# Altium schematic sheet Attachments.SchDoc
size A
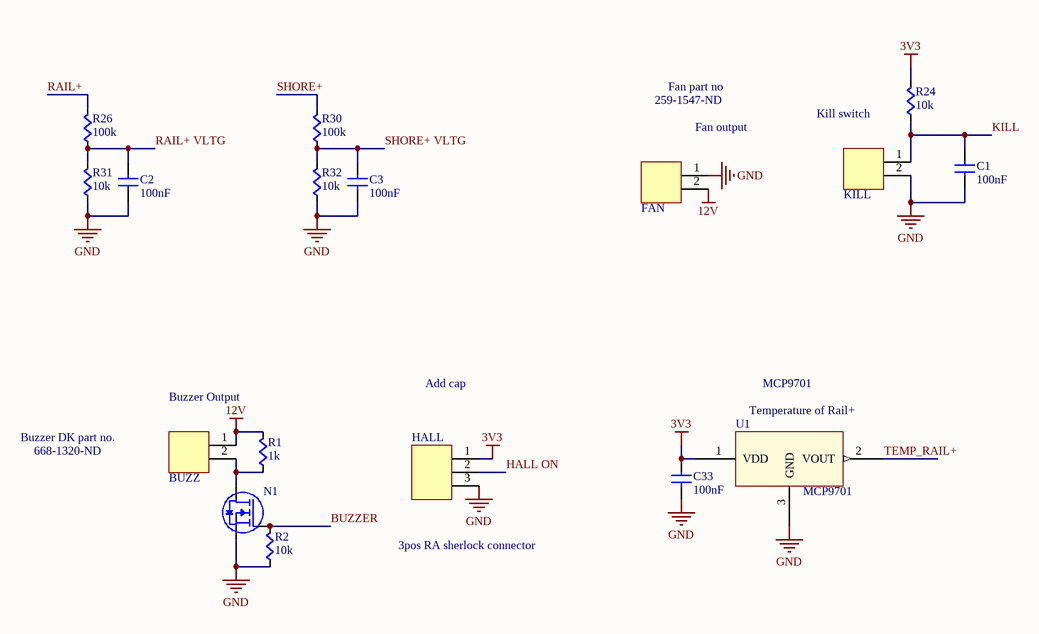
[diagram p0: Attachments.SchDoc]

## Parts
BUZZ  2-pin Horz Sherlock  [MOLEX-HDR-1X2-SHERLOCK-HORZ]  (value not drawn)
C1  value 100nF  [CAPC0603]  (hidden comment: Cap)
C2  value 100nF  [CAPC0603]  (hidden comment: Cap)
C3  value 100nF  [CAPC0603]  (hidden comment: Cap)
C33  value 100nF  [CAPC0603]  (hidden comment: Cap)
FAN  2-pin Horz Sherlock  [MOLEX-HDR-1X2-SHERLOCK-HORZ]  (value not drawn)
HALL  3pos RA sherlock connector  [MOLEX-HDR-1X3-SHERLOCK-RA]
KILL  2-pin Horz Sherlock  [MOLEX-HDR-1X2-SHERLOCK-HORZ]  (value not drawn)
N1  NMOSFET  [2N7002P,215]  (value not drawn)
R1  value 1k  [RES0603]  (hidden comment: Res)
R2  value 10k  [RES0603]  (hidden comment: Res)
R24  value 10k  [RES0603]  (hidden comment: Res)
R26  value 100k  [RES0603]  (hidden comment: Res)
R30  value 100k  [RES0603]  (hidden comment: Res)
R31  value 10k  [RES0603]  (hidden comment: Res)
R32  value 10k  [RES0603]  (hidden comment: Res)
U1  MCP9701  [MCP970X-E/TT]

## Nets
3V3: C33.2(B) HALL.1 R24.1(A) U1.1(VDD)
12V: BUZZ.1 FAN.2 R1.1(A)
GND: C1.2(B) C2.2(B) C3.2(B) C33.1(A) FAN.1 HALL.3 KILL.2 N1.2(S) R2.2(B) R31.2(B) R32.2(B) U1.3(GND)
BUZZER: N1.1(G) R2.1(A)
HALL ON: HALL.2
KILL: C1.1(A) KILL.1 R24.2(B)
RAIL+: R26.1(A)
RAIL+ VLTG: C2.1(A) R26.2(B) R31.1(A)
SHORE+: R30.1(A)
SHORE+ VLTG: C3.1(A) R30.2(B) R32.1(A)
TEMP_RAIL+: U1.2(VOUT)
NetBUZZ_2: BUZZ.2 N1.3(D) R1.2(B)

## Notes on the sheet
- Fan part no
- 259-1547-ND
- (near FAN) Fan output
- Kill switch
- Buzzer Output
- Add cap
- (near U1) Temperature of Rail+
- MCP9701
- Buzzer DK part no.
- 668-1320-ND

## Library data of the parts
BUZZ FAN KILL = MOLEX-HDR-1x2-SHERLOCK_RA: Header, Molex, 2mm Pitch Sherlock Header, Single Row, Horizontal, 2 Circuits, Length 3.3mm,  0353630260; Manufacturer: Molex Inc; Manufacturer Part Number: 0353630260; Supplier Part Number: WM18931-ND; Supplier: Digi-Key
HALL = MOLEX-HDR-1x3-SHERLOCK_RA: Header, Molex, 2mm Pitch Sherlock Header, Single Row, Right Angle 3 Circuits, Length 3.3mm; Manufacturer Part Number: 35363-0360; Manufacturer: Molex Connector Corporation; Supplier Part Number: WM18932-ND; Supplier: Digi-Key
N1 = NMOSFET: NMOSFET Template; Supplier 1: Digi-Key; Supplier Part Number 1: 568-5818-1-ND
U1 = MCP970x: Low-Power Linear Active Thermistor ICs; Supplier 1: Digi-Key; Supplier Part Number 1: MCP9701AT-E/TTCT-ND
C1-C3 C33 = Cap: Supplier 1: Digi-Key; Supplier Part Number 1: 1276-1000-1-ND
R1 R2 R24 R26 R30-R32 = Res: Supplier 1: Digi-Key
  R1: Supplier Part Number 1: RMCF0603JT1K00CT-ND
  R2 R24: Supplier Part Number 1: RMCF0603JT10K0CT-ND
  R26 R30: Supplier Part Number 1: RR08P100KDCT-ND
  R31 R32: Supplier Part Number 1: RR08P10.0KDCT-ND